# EAGLE board KVR LABS - AEV ENCODER 1.01-STM32 (EAGLE 9.6.1)
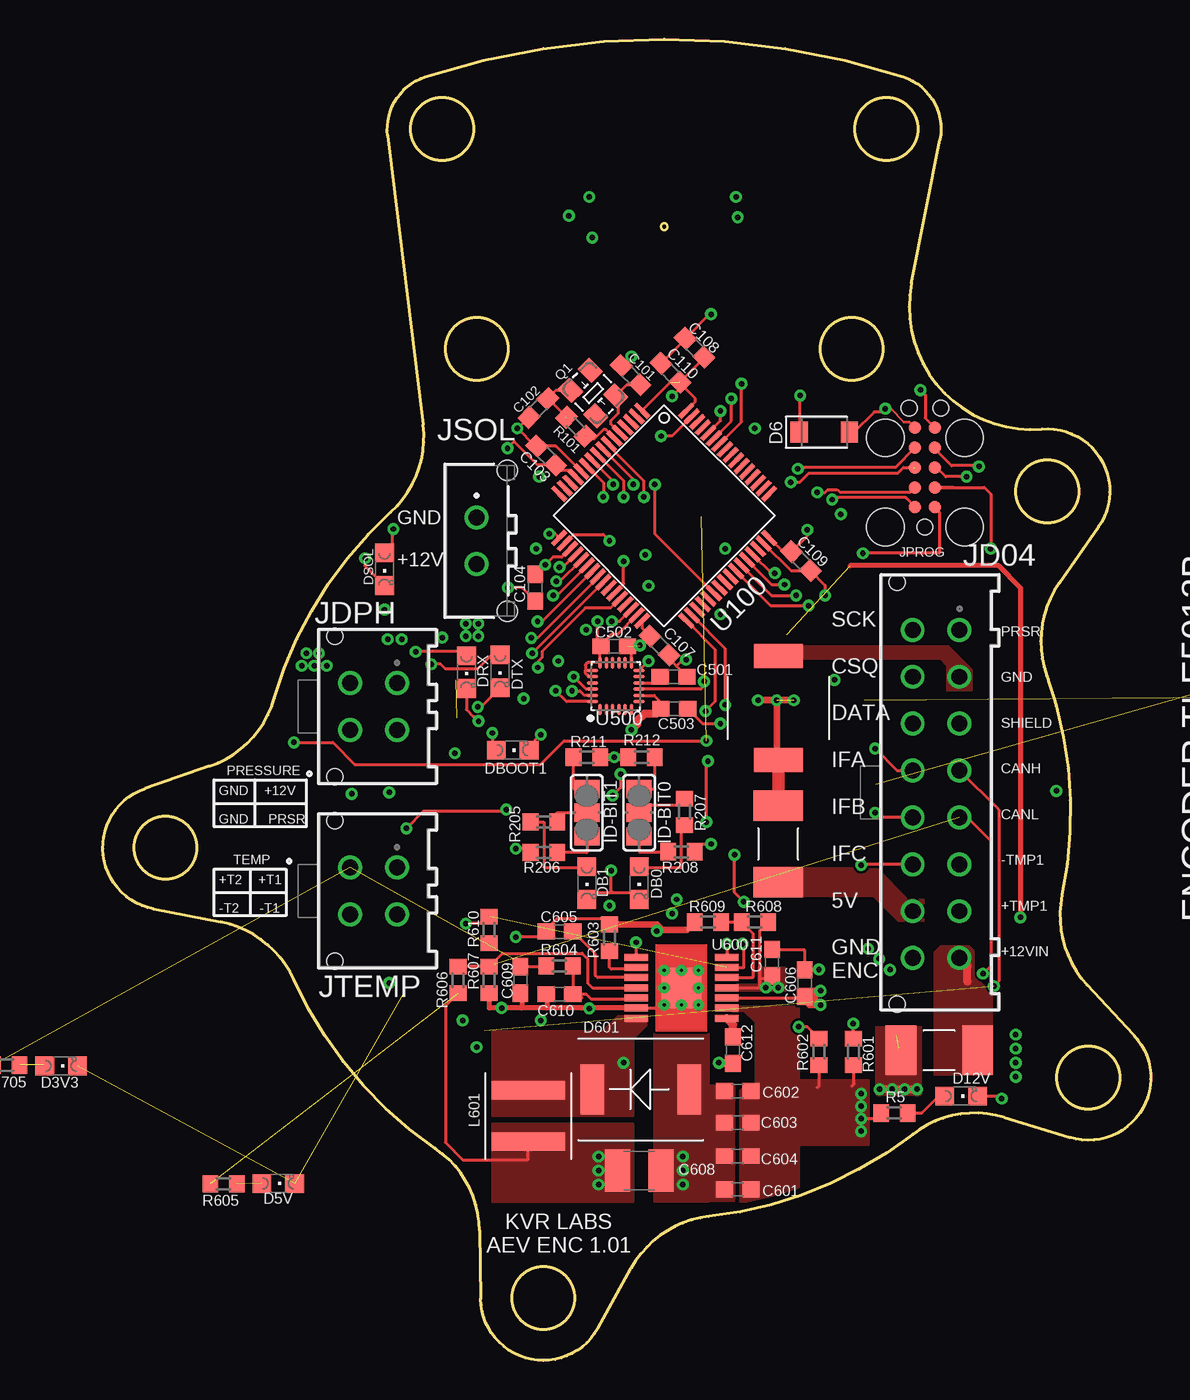
[diagram p9: board, top side]
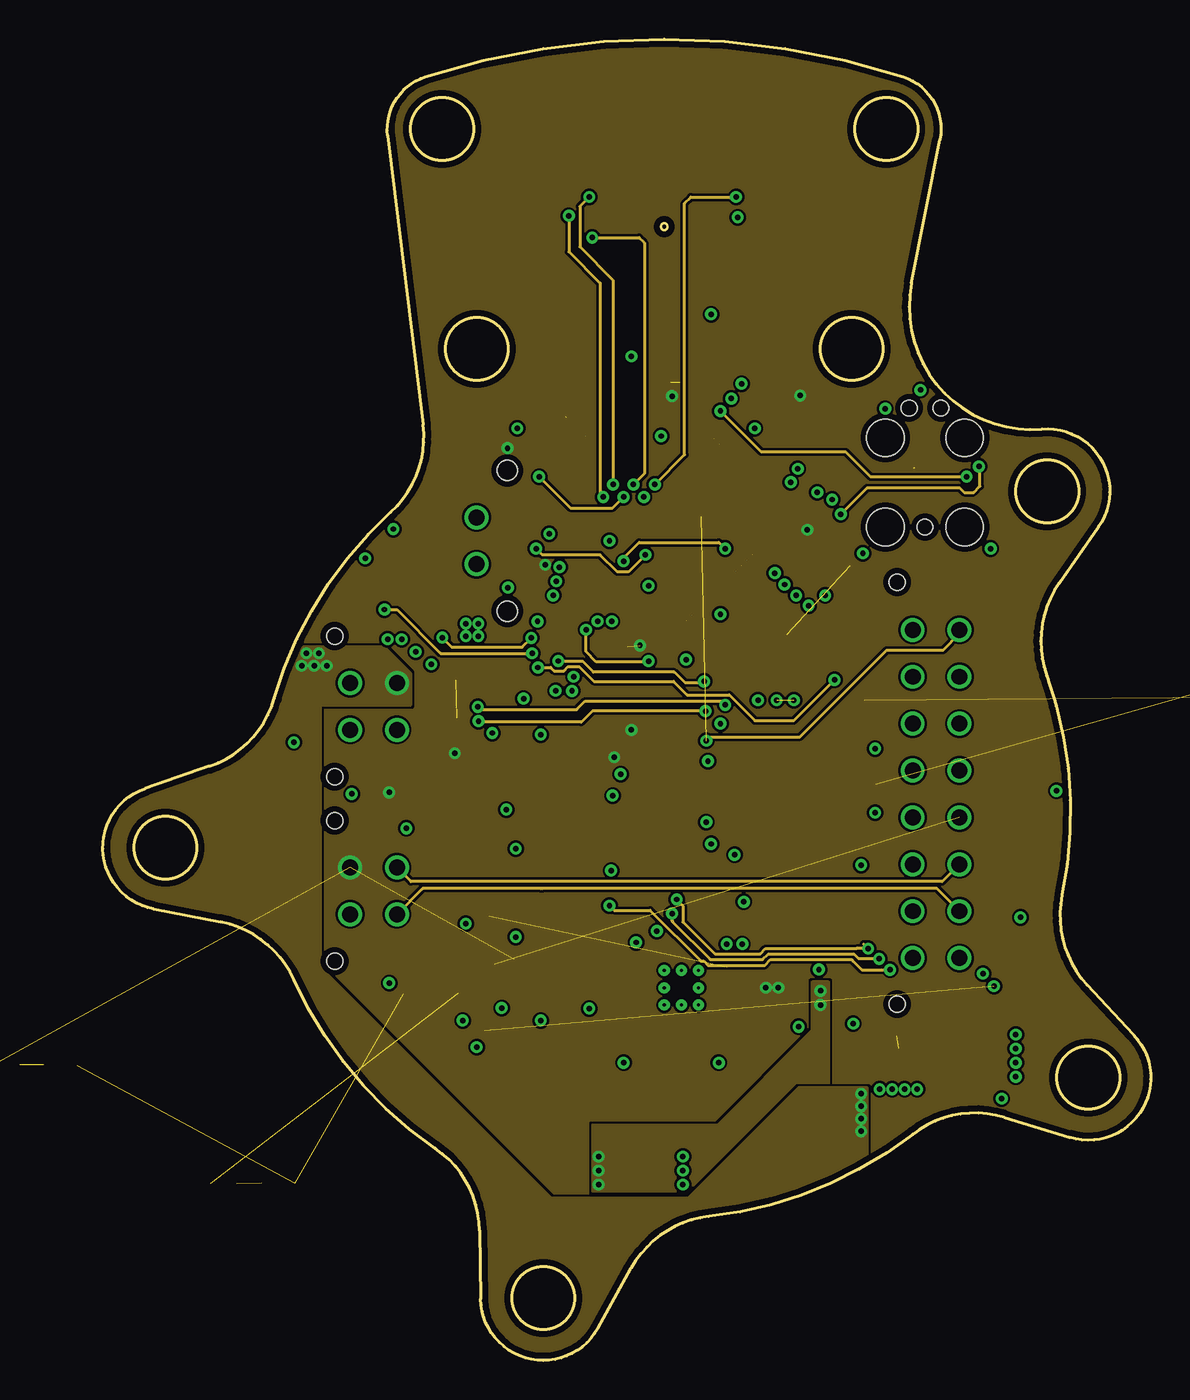
[diagram p10: board, inner layer Route2]
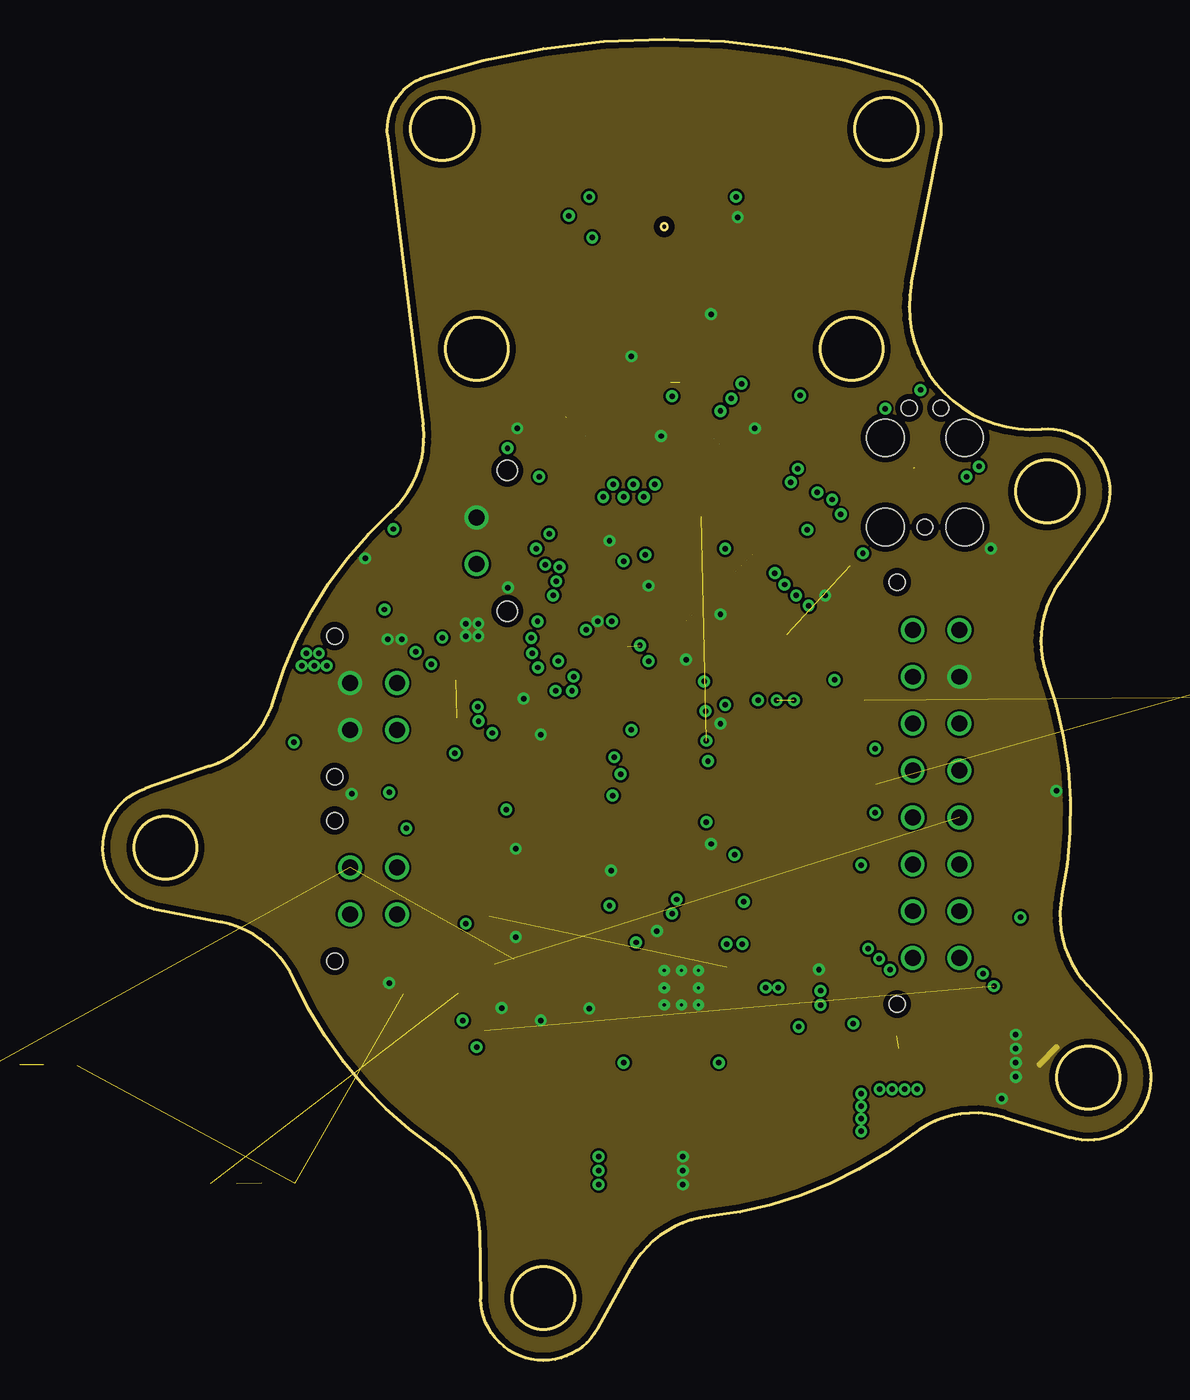
[diagram p11: board, inner layer Route15]
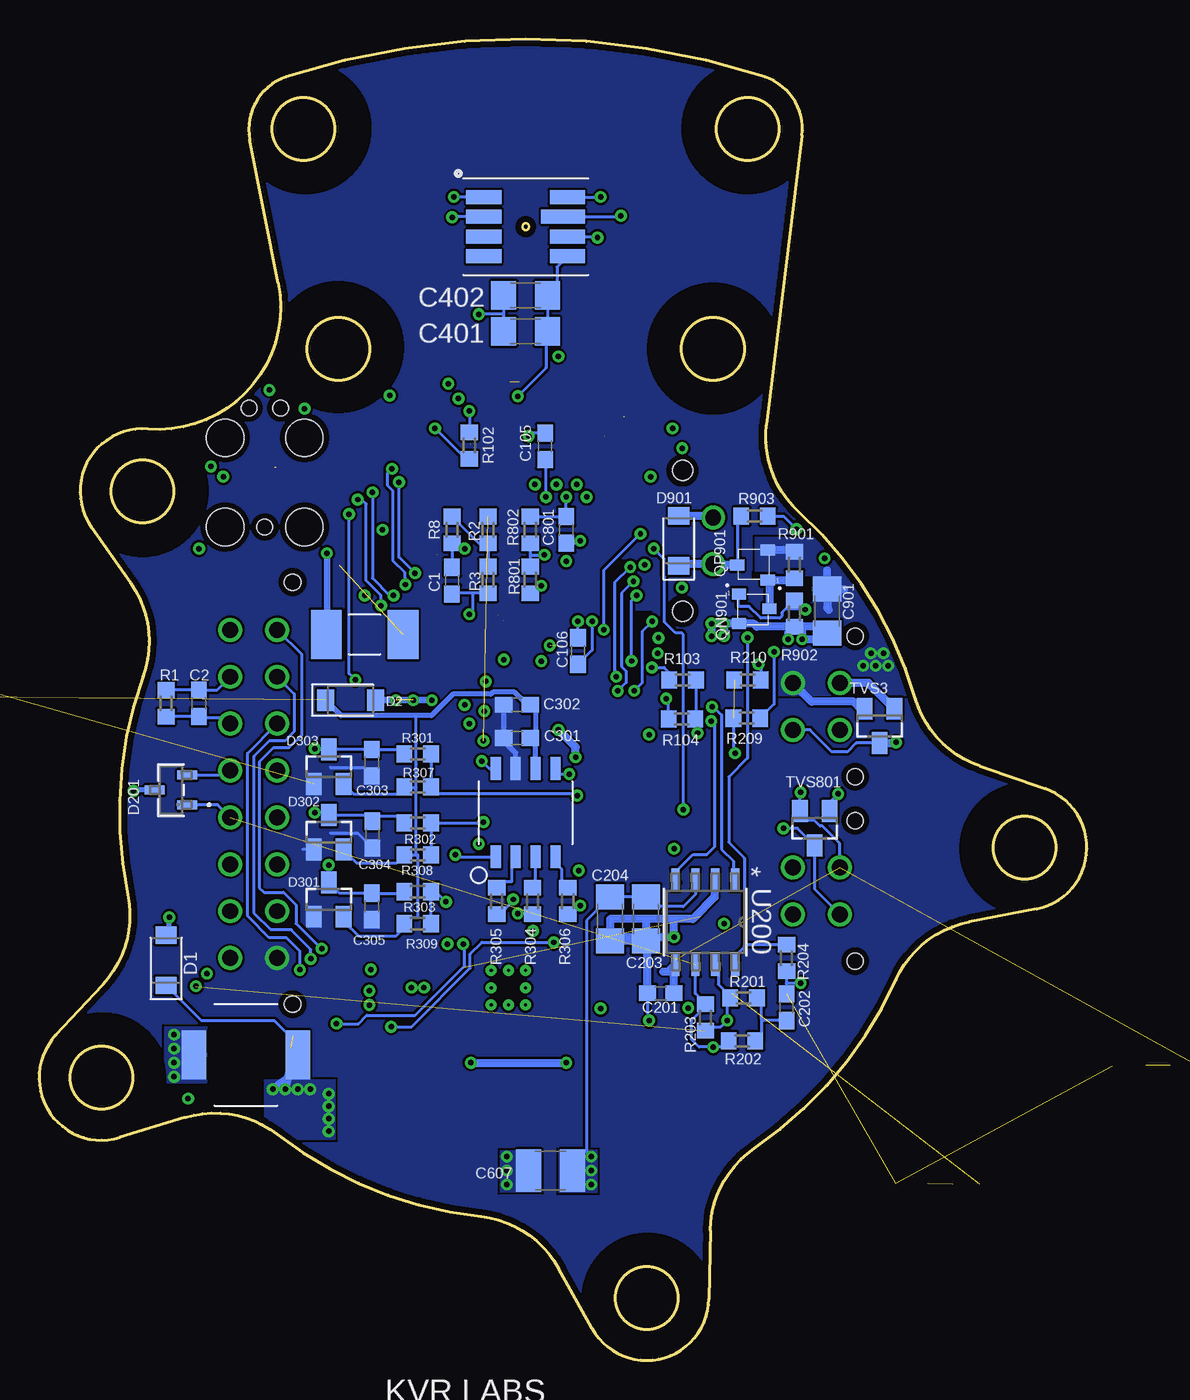
[diagram p12: board, bottom side, seen from below]

Size 67.06 x 84.55 mm. Coordinates in mm from the lower left corner, seen from the top.
Outline: 18.23,78.37 arc-79 20.62,82.13 arc-36 51.22,82.13 arc-83 53.57,78.11 51.75,68.94 arc106 60.1,59.6 arc-130 63.71,53.32 61.2,49.73 arc55 60.4,43.81 arc-31 61.38,29.78 arc55 62.99,24.03 65.98,20.82 arc-150 61.89,14.27 57.69,15.55 arc55 51.82,14.48 arc-31 38.78,9.21 arc55 33.81,5.9 31.68,2.06 arc-150 24.18,3.93 24.1,8.32 arc55 21.27,13.57 arc-31 12.23,24.35 arc55 7.54,28.05 3.24,28.89 arc-150 2.7,36.6 6.84,38.03 arc55 10.97,42.35 arc-31 18.42,54.28 arc55 20.5,59.88 18.23,78.37
Outline: circle at 28.18,4 radius 2
Outline: circle at 4,32.82 radius 2
Outline: circle at 23.93,64.72 radius 2
Outline: circle at 21.71,78.8 radius 2
Outline: circle at 50.14,78.8 radius 2
Outline: circle at 60.43,55.62 radius 2
Outline: circle at 63.06,18.09 radius 2
Outline: circle at 35.92,72.55 radius 0.2
Outline: circle at 47.91,64.72 radius 2
Copper layers (1*2*15*16): Top 0.035mm / dielectric 1.15mm / Route2 0.035mm / dielectric 0.15mm / Route15 0.035mm / dielectric 0.2mm / Bottom 0.035mm
Design rules "default *": minimum track width 0.14mm, minimum drill 0.35mm, track to track 6mil, track to pad 6mil, pad to pad 6mil, via to via 6mil, smd to smd 0mil, copper to edge 15mil, drill to drill 5mil, minimum pad ring 10mil, minimum via ring 8mil, stop-mask expansion 4mil, vias tented up to drill 0mil, thermal gap 0mil
Net classes: 0 default: width 0.203 mm, drill 0.3 mm, clearance 0.152 mm; 1 power: width 0.175 mm, drill 0.3 mm, clearance 0.175 mm
tRestrict: area 0,28.8 to 8,36.8; area 24.2,-0.1 to 32.2,7.9; area 59,14 to 67,22; area 56.6,51.7 to 64.6,59.7; area 17.6,74.8 to 25.6,82.8; area 46,74.8 to 54,82.8; area 43.9,60.7 to 51.9,68.7; area 19.9,60.6 to 27.9,68.6; area 40.9,17.8 to 41.4,18.4; area 39.8,19.7 to 40.8,20
bRestrict: area 19.5,45.2 to 19.9,46.3; area 17.6,49.7 to 18.7,50.1; area 17.5,47.3 to 17.9,48.4; area 17.6,48.5 to 18,49.6; area 20.2,50 to 21.3,50.4; area 27.9,47.4 to 29,47.8; area 29.2,50.7 to 30.3,51.1; area -0.1,28.7 to 7.9,36.7; area 24.1,-0.1 to 32.1,7.9; area 59,14 to 67,22; area 56.4,51.6 to 64.4,59.6; area 46,74.8 to 54,82.8; area 17.7,74.8 to 25.7,82.8; area 19.9,60.7 to 27.9,68.7; area 43.9,60.8 to 51.9,68.8

## Footprints (pad centres in the part's own frame; a part is rotated, then mirrored left to right if it is on the bottom)
C0603 = smd 1.1 x 1: 1 -0.85,0; 2 0.85,0
C1206 = smd 1.6 x 1.8: 1 -1.4,0; 2 1.4,0
C1210 = smd 1.6 x 2.7: 1 -1.4,0; 2 1.4,0
SODFL3718X115 = smd 1.115 x 1.361: 1 -1.6,0; 2 1.6,0
CHIPLED_0805 = smd 1.2 x 1.2: A 0,-1.05; C 0,1.05
SOT-23_3L_ONS = smd 0.568 x 1.259: 1 -0.953,-1.041; 2 0.953,-1.041; 3 0,1.041
SOT23 = smd 1 x 1.4: 1 -0.95,-1.1; 2 0.95,-1.1; 3 0,1.1
DO-214AB = smd 1.52 x 3.2: ANODE 3.105,0; CATHODE -3.105,0
2410(6125METRIC) = smd 1.96 x 3.15: P1 -2.455,0; P2 2.455,0
SJ_2 = smd 1.168 x 1.6: 1 -1.524,0; 2 0,0; 3 1.524,0
66201621122 = drill 1.02: 1 10.4,-1.5; 2 7.4,-1.5; 3 4.4,-1.5; 4 1.4,-1.5; 5 -1.6,-1.5; 6 -4.6,-1.5; 7 -7.6,-1.5; 8 -10.6,-1.5; 9 10.4,1.5; 10 7.4,1.5; 11 4.4,1.5; 12 1.4,1.5; 13 -1.6,1.5; 14 -4.6,1.5; 15 -7.6,1.5; 16 -10.6,1.5 | hole 1.02: -13.55,2.49; 13.45,2.49
66200421122 = drill 1.02: 1 1.5,-1.5; 2 -1.5,-1.5; 3 1.5,1.5; 4 -1.5,1.5 | hole 1.02: -4.5,2.49; 4.5,2.49
TC2050-IDC = smd 0.787 x 0.787: 1 -2.54,-0.635; 2 -2.54,0.635; 3 -1.27,-0.635; 4 -1.27,0.635; 5 0,-0.635; 6 0,0.635; 7 1.27,-0.635; 8 1.27,0.635; 9 2.54,-0.635; 10 2.54,0.635 | hole 0.991: -3.81,0; 3.81,1.016; 3.81,-1.016 | hole 2.375: -3.81,2.54; -3.81,-2.54; 1.905,2.54; 1.905,-2.54
66200211122 = drill 1.02: 1 1.5,0; 2 -1.5,0 | hole 1.27: 4.5,-1.96; -4.5,-1.96
XAL5030 = smd 1.18 x 4.7: P1 -1.655,0; P2 1.655,0
CRY3225-4 = smd 1.3 x 1.1: 1 -1.15,-0.9; 2 -1.15,0.9; 3 1.15,0.9; 4 1.15,-0.9
SOT323-3_NFET = smd 0.9 x 0.7: D 1.059,0; G -0.889,0.95; S -0.889,-0.95
R0603 = smd 1 x 1.1: 1 -0.85,0; 2 0.85,0
SMC = smd 1.54 x 3.14: P$1 -3.325,0; P$2 3.325,0
LQFP64_STMLIB = smd 0.3 x 1.2: 1 -3.75,-5.75; 2 -3.25,-5.75; 3 -2.75,-5.75; 4 -2.25,-5.75; 5 -1.75,-5.75; 6 -1.25,-5.75; 7 -0.75,-5.75; 8 -0.25,-5.75; 9 0.25,-5.75; 10 0.75,-5.75; 11 1.25,-5.75; 12 1.75,-5.75; 13 2.25,-5.75; 14 2.75,-5.75; 15 3.25,-5.75; 16 3.75,-5.75; 33 3.75,5.75; 34 3.25,5.75; 35 2.75,5.75; 36 2.25,5.75; 37 1.75,5.75; 38 1.25,5.75; 39 0.75,5.75; 40 0.25,5.75; 41 -0.25,5.75; 42 -0.75,5.75; 43 -1.25,5.75; 44 -1.75,5.75; 45 -2.25,5.75; 46 -2.75,5.75; 47 -3.25,5.75; 48 -3.75,5.75 | smd 1.2 x 0.3: 17 5.75,-3.75; 18 5.75,-3.25; 19 5.75,-2.75; 20 5.75,-2.25; 21 5.75,-1.75; 22 5.75,-1.25; 23 5.75,-0.75; 24 5.75,-0.25; 25 5.75,0.25; 26 5.75,0.75; 27 5.75,1.25; 28 5.75,1.75; 29 5.75,2.25; 30 5.75,2.75; 31 5.75,3.25; 32 5.75,3.75; 49 -5.75,3.75; 50 -5.75,3.25; 51 -5.75,2.75; 52 -5.75,2.25; 53 -5.75,1.75; 54 -5.75,1.25; 55 -5.75,0.75; 56 -5.75,0.25; 57 -5.75,-0.25; 58 -5.75,-0.75; 59 -5.75,-1.25; 60 -5.75,-1.75; 61 -5.75,-2.25; 62 -5.75,-2.75; 63 -5.75,-3.25; 64 -5.75,-3.75
SO-8_S_LIT = smd 1.455 x 0.533: 1 -2.721,1.905; 2 -2.721,0.635; 3 -2.721,-0.635; 4 -2.721,-1.905; 5 2.721,-1.905; 6 2.721,-0.635; 7 2.721,0.635; 8 2.721,1.905
PG-DSO-8 = smd 0.65 x 1.45: P1 -1.905,-2.825; P2 -0.635,-2.825; P3 0.635,-2.825; P4 1.905,-2.825; P5 1.905,2.825; P6 0.635,2.825; P7 -0.635,2.825; P8 -1.905,2.825
MS5541C = smd 2.25 x 0.9: P1 -2.675,1.9; P2 -2.675,0.65; P3 -2.675,-0.65; P4 -2.675,-1.9; P5 2.675,-1.9; P6 2.675,-0.65; P8 2.675,1.9 | smd 2.8 x 0.9: P7 2.4,0.65
ICM-20648 = smd 0.738 x 0.22: 1 -1.496,1; 2 -1.496,0.6; 3 -1.496,0.2; 4 -1.496,-0.2; 5 -1.496,-0.6; 6 -1.496,-1; 13 1.496,-1; 14 1.496,-0.6; 15 1.496,-0.2; 16 1.496,0.2; 17 1.496,0.6; 18 1.496,1 | smd 0.22 x 0.738: 7 -1,-1.496; 8 -0.6,-1.496; 9 -0.2,-1.496; 10 0.2,-1.496; 11 0.6,-1.496; 12 1,-1.496; 19 1,1.496; 20 0.6,1.496; 21 0.2,1.496; 22 -0.2,1.496; 23 -0.6,1.496; 24 -1,1.496
14-HTSSOP = smd 1.5 x 0.45: P1 -2.9,1.95; P2 -2.9,1.3; P3 -2.9,0.65; P4 -2.9,0; P5 -2.9,-0.65; P6 -2.9,-1.3; P7 -2.9,-1.95; P8 2.9,-1.95; P9 2.9,-1.3; P10 2.9,-0.65; P11 2.9,0; P12 2.9,0.65; P13 2.9,1.3; P14 2.9,1.95 | smd 2.56 x 2.56: P15 0,0 | drill 0.2 pad 0.35: P16 0,-1.1; P17 0,1.1; P18 -1.1,-1.1; P19 1.1,-1.1; P20 1.1,0; P21 1.1,1.1; P22 -1.1,1.1; P23 -1.1,0

## Placement (x,y rotation side)
C1  .1nF  [C0603]  40.64,49.9 270 bottom
C2  .1nF  [C0603]  56.82,42.05 90 bottom
C101  12pF  [C0603]  33.77,63.05 135 top
C102  12pF  [C0603]  27.87,60.95 225 top
C103  100nF  [C0603]  28.37,57.9 135 top
C104  10uF  [C0603]  27.67,49.45 270 top
C105  100nF  [C0603]  34.67,58.5 90 bottom
C106  4.7uF  [C0603]  32.57,45.4 270 bottom
C107  100nF  [C0603]  35.62,45.75 315 top
C108  100nF  [C0603]  37.87,64.8 135 top
C109  100nF  [C0603]  44.67,51.15 315 top
C110  100nF  [C0603]  36.32,63.2 135 top
C201  0.1uF  [C0603]  27.27,23.5 180 bottom
C202  0.1uF  [C0603]  19.22,22.6 90 bottom
C203  22uF  [C1206]  28.22,28.25 270 bottom
C204  22uF  [C1206]  30.52,28.25 270 bottom
C301  1uF  [C0603]  36.47,39.83 180 bottom
C302  100nF  [C0603]  36.47,41.97 180 bottom
C303  DNP  [C0603]  45.77,38.25 270 bottom
C304  DNP  [C0603]  45.72,33.65 270 bottom
C305  DNP  [C0603]  45.77,29.05 270 bottom
C401  22uF  [C1206]  35.92,65.85 180 bottom
C402  22uF  [C1206]  35.92,68.15 180 bottom
C501  0.1uF  [C0603]  36.52,43.75 0 top
C502  0.1uF  [C0603]  32.72,45.7 180 top
C503  0.1uF  [C0603]  36.57,41.7 0 top
C601  22uF  [C0603]  40.62,10.95 180 top
C602  22uF  [C0603]  40.62,17.25 180 top
C603  22uF  [C0603]  40.62,15.22 180 top
C604  22uF  [C0603]  40.62,13.08 180 top
C605  3.3nF  [C0603]  29.22,27.45 180 top
C606  4.7uF  [C0603]  44.92,24.15 90 top
C607  47uF  [C1210]  34.32,12.15 180 bottom
C608  47uF  [C1210]  34.32,12.15 0 top
C609  4.7nF  [C0603]  26.72,24.35 270 top
C610  12pF  [C0603]  29.22,23.45 180 top
C611  10uF  [C0603]  42.82,25.45 90 top
C612  0.1uF  [C0603]  40.32,19.85 90 top
C801  100nF  [C0603]  33.32,53.15 270 bottom
C901  22uF  [C1206]  16.62,47.95 270 bottom
D1  MBR0520LT1G  [SODFL3718X115]  58.92,25.6 90 bottom
D2  MBR0520LT1G  [SODFL3718X115]  47.12,42.25 0 bottom
D3V3  [CHIPLED_0805]  -2.68,18.85 270 top
D5V  [CHIPLED_0805]  11.22,11.32 270 top
D5V_ENC  [CHIPLED_0805]  80.39,46.75 180 top  (outside the outline)
D6  MBR0520LT1G  [SODFL3718X115]  46.17,59.4 0 top
D12V  [CHIPLED_0805]  54.92,16.92 270 top
D201  μCLAMP2492SQ  [SOT-23_3L_ONS]  58.62,36.5 90 bottom
D301  BAS70-04  [SOT23]  48.52,29.5 0 bottom
D302  BAS70-04  [SOT23]  48.52,33.8 0 bottom
D303  BAS70-04  [SOT23]  48.52,38 0 bottom
D601  SL44  [DO-214AB]  34.42,17.35 0 top
D901  MBR0520LT1G  [SODFL3718X115]  26.12,52.45 90 bottom
DB0  [CHIPLED_0805]  34.32,30.55 180 top
DB1  [CHIPLED_0805]  30.97,30.55 180 top
DBOOT1  [CHIPLED_0805]  26.22,39.05 270 top
DRX  [CHIPLED_0805]  23.27,44.05 180 top
DSOL  [CHIPLED_0805]  18.02,50.63 180 top
DTX  [CHIPLED_0805]  25.42,44.1 180 top
F1  0679L3000  [2410(6125METRIC)]  53.52,19.85 0 top
F2  0679L0250  [2410(6125METRIC)]  43.22,33.05 90 top
F3  0679L0250  [2410(6125METRIC)]  46.22,46.45 0 bottom
ID-BIT0  [SJ_2]  34.32,35.05 270 top
ID-BIT1  [SJ_2]  30.97,35.05 270 top
JD04  [66201621122]  53.32,36.35 90 top
JDPH  [66200421122]  17.32,41.85 90 top
JPROG  TC2050-IDC  [TC2050-IDC]  52.61,57.14 90 top
JSOL  [66200211122]  23.92,52.45 90 top
JTEMP  [66200421122]  17.32,30.05 90 top
L601  XAL5030  [XAL5030]  27.22,15.65 270 top
Q1  16MHz  [CRY3225-4]  31.37,61.9 315 top
QN901  FDV305N  [SOT323-3_NFET]  21.37,48.1 0 bottom
QP901  ZXM61P02FTA  [SOT323-3_NFET]  21.32,50.9 180 bottom
R1  1M  [R0603]  58.92,42.05 90 bottom
R2  10k  [R0603]  38.32,53.15 270 bottom
R3  10k  [R0603]  38.32,49.95 270 bottom
R5  10k  [R0603]  50.65,15.83 180 top
R6  10k  [R0603]  80.37,43.37 270 top  (outside the outline)
R8  100  [R0603]  40.62,53.15 270 bottom
R101  220  [R0603]  30.27,59.75 315 top
R102  100k  [R0603]  39.52,58.55 270 bottom
R103  10k  [R0603]  25.87,43.55 0 bottom
R104  100k  [R0603]  25.92,41.05 180 bottom
R201  60  [R0603]  21.97,23.2 180 bottom
R202  60  [R0603]  22.07,20.45 0 bottom
R203  DNP  [R0603]  24.42,21.95 270 bottom
R204  10k  [R0603]  19.22,25.75 90 bottom
R205  10k  [R0603]  28.22,34.45 180 top
R206  1k  [R0603]  28.22,32.5 180 top
R207  10k  [R0603]  37.22,35.1 270 top
R208  1k  [R0603]  37.02,32.55 0 top
R209  1k  [R0603]  21.77,41.1 180 bottom
R210  1k  [R0603]  21.72,43.55 180 bottom
R211  1k  [R0603]  30.97,38.6 180 top
R212  1k  [R0603]  34.47,38.6 0 top
R301  0  [R0603]  42.82,38.8 180 bottom
R302  0  [R0603]  42.82,34.4 180 bottom
R303  0  [R0603]  42.82,30 180 bottom
R304  100  [R0603]  35.47,29.4 270 bottom
R305  100  [R0603]  37.77,29.4 270 bottom
R306  470  [R0603]  33.22,29.4 270 bottom
R307  DNP  [R0603]  42.82,36.7 180 bottom
R308  DNP  [R0603]  42.82,32.35 180 bottom
R309  DNP  [R0603]  42.82,27.95 180 bottom
R601  10k  [R0603]  48.02,19.75 270 top
R602  10k  [R0603]  45.82,19.75 270 top
R603  47k  [R0603]  32.42,27.05 270 top
R604  22k  [R0603]  29.22,25.25 0 top
R605  10k  [R0603]  7.72,11.3 180 top
R606  56.25k  [R0603]  22.72,24.35 270 top
R607  10k  [R0603]  24.72,24.35 90 top
R608  95.3k  [R0603]  41.72,28.05 0 top
R609  18k  [R0603]  38.72,28.05 0 top
R610  DNP  [R0603]  24.72,27.55 90 top
R705  10k  [R0603]  -6.18,18.9 180 top  (outside the outline)
R801  10k  [R0603]  35.62,49.95 270 bottom
R802  100  [R0603]  35.62,53.15 90 bottom
R901  10k  [R0603]  18.72,50.9 90 bottom
R902  10k  [R0603]  18.72,47.8 90 bottom
R903  10k  [R0603]  21.27,54.02 180 bottom
TVS1  SM15T18AY  [SMC]  53.82,19.55 0 bottom
TVS2  SM15T6V8AY  [SMC]  43.22,41.75 270 top
TVS3  BAS70-04  [SOT23]  13.27,40.6 180 bottom
TVS801  BAS70-04  [SOT23]  17.42,34.05 180 bottom
U100  STM32F413RGT6  [LQFP64_STMLIB]  35.92,54.05 225 top
U200  TJA1044GT/3  [SO-8_S_LIT]  24.42,28.05 270 bottom
U300  TLE5012B  [PG-DSO-8]  35.92,35.05 0 bottom
U400  MS5541C  [MS5541C]  35.92,72.55 0 bottom
U500  ICM-20648  [ICM-20648]  32.82,43.15 90 top
U600  TPS65321-Q1  [14-HTSSOP]  37.02,23.85 180 top

## Tracks (layer width: path | path; a pad name or v marks a point on that pad's centre or on a via)
+3V3  (via drill 0.35)  (5 unrouted)
  Top 0.203: U500.13 33.82,45.35 C502.1 34.37,45.7 C107.1 34.51,46.86 U100.32 | U500.8 35.27,42.55 35.8,42.02 C503.1 | 36.92,62.35 C110.1 38.47,64.15 C108.1 | 36.92,62.35 36.92,62.2 v36.42,61.7 | U100.13 30.26,56.54 29.85,56.96 29.32,56.96 C103.1 27.82,57.3 26.32,58.8 v25.9,58.37 | U100.1 36.34,62.6 | U100.64 37.92,61.35 37.92,61.55 37.12,62.35 36.92,62.35 | U100.48 43.52,51.75 C109.1 45.08,52.76 v45.08,53.15 | U100.19 29.38,51.4 28.79,51.4 v28.31,50.92 27.69,50.3 C104.1 | 33.52,38.6 R212.1 | v44.62,61.75 44.57,61.7 D6.1 | C611.1 42.82,24.45 | 42.02,24.45 42.02,23.85 | U600.P4 42.02,23.85 | R608.2 42.02,27.5 42.02,24.45 | 42.02,24.45 42.42,24.45 | 42.42,24.45 42.82,24.45 | v42.42,23.85 42.42,24.45 | 42.02,23.85 v42.42,23.85 | v42.42,23.85 v43.22,23.85 42.82,24.25 42.82,24.45
  Top 0.5: C503.1 35.4,41.38 34.65,41.38 34.19,40.92 34.19,40.72 v33.82,40.35 | R211.1 v32.72,38.6 33.52,38.6
  Bottom 0.203: R209.2 22.62,38.95 v22.52,38.85 | U200.5 26.33,25.65 | JTEMP.3 15.82,33.1 16.92,34.2 17.08,34.2 17.43,34.55 18.02,34.55 18.37,34.9 TVS801.2 18.37,36.3 v18.32,36.35 | U400.P5 33.92,69.97 33.92,68.75 C402.1 C401.1 34.62,65.75 34.62,63.5 v36.42,61.7
  Bottom 0.5: C201.1 26.42,25.23 | 26.42,25.23 U200.5 | 27.12,24.88 26.77,24.88 26.42,25.23 | v32.72,38.6 32.72,39.25 v33.82,40.35
  other vias: 34.37,45.75
  pour Route2 (isolate 0.127, rank 6): -15.68,63.7 -15.68,16.55 15.87,-15 64.27,-15 93.42,14.15 93.42,58.2 65.52,86.1 6.72,86.1
  pour Top: 40.52,23.65 43.72,23.65 43.72,25.15 41.92,25.15 41.92,24.05 40.52,24.05
+5V  (via drill 0.35)  (1 unrouted)
  Top 0.203: R606.2 21.92,22.7 21.92,13.95 23.02,12.85 27.18,12.85 27.22,12.89 L601.P2 | U600.P3 44.82,23.2 C606.1 44.62,23
  Top 0.406: 45.37,23.3 C606.1 45.27,23.65 v45.92,23.65 45.47,23.2 | 45.47,23.2 45.37,23.3 | 45.47,23.2 v45.92,22.75 45.22,22.75 45.22,23.15 45.37,23.3
  Bottom 0.203: U200.3 25.06,29.81 25.82,29.05 27.62,29.05 28.02,29.45 | C203.1 30.12,29.65 30.32,29.45 | C204.1 32.02,28.15 32.02,13.35 v31.72,13.05
  Bottom 0.5: 28.02,29.45 C203.1 28.42,29.45 | C204.1 30.32,29.45 30.81,29.45
  other vias: 31.72,12.15 31.72,11.25
  pour Top: 33.92,10.15 33.92,15.15 24.92,15.15 24.92,10.15
  pour Bottom: 33.82,10.75 31.32,10.75 31.32,13.45 33.82,13.45
  pour Route2 (rank 2): 31.32,14.35 32.02,15.05 39.32,15.05 45.42,21.15 45.42,24.25 46.42,24.25 46.42,17.35 43.42,14.35
  pour Route2 (rank 3): 42.22,15.05 31.32,15.05 31.32,10.85 42.22,10.85
+5V/1  (1 unrouted)
  Bottom 0.203: D303.2 46.92,36.25 44.02,36.25 43.67,36.6 R307.2 43.62,36.65 42.92,36.65 | D301.2 47.57,28.1 46.62,27.15 44.22,27.15 43.67,27.7 R309.2 43.27,28.35 42.82,28.35 42.82,32.35 42.92,32.35 | 42.92,32.35 42.92,36.65 | 42.92,36.65 42.92,38.14 42.92,39.45 42.92,39.46 42.92,41.26 | 42.92,32.35 R308.2 44.17,31.85 46.72,31.85 D302.2 47.52,32.65 | C302.1 35.91,41.97 36.67,42.72 39.72,42.72
  Bottom 0.305: U300.P6 35.29,39.75 | 35.29,39.75 35.29,41.63 C302.1 35.84,41.97 36.65,42.77 38,42.77 38.14,42.63 40.57,42.63 41.94,41.26 42.92,41.26 47.74,41.26 D2.1 | C301.1 35.54,39.75 35.29,39.75
+12V  (via drill 0.35)  (1 unrouted)
  Top 0.203: R5.2 49.43,15.47 v48.52,15.47 | R602.2 45.82,17.55 45.72,17.45 | R601.2 48.02,17.65 47.92,17.55
  Top 0.5: v52.11,17.35 v51.31,17.35 v50.51,17.35 v49.71,17.35
  Bottom 0.203: D1.1 56.67,21.75 52.01,21.75 50.28,20.02
  Bottom 0.5: TVS1.P$2 50.49,19.51 50.75,19.25 | 50.75,18.35 50.73,18.37 v52.11,17.35 | 50.28,20.02 50.63,19.66 | TVS1.P$2 50.51,19.54 50.63,19.66 | 50.64,20.77 50.72,20.85 50.81,20.77 | v51.31,17.35 50.83,19.17 50.75,19.25 | 50.94,19.97 50.63,19.66 | 50.75,19.25 50.55,19.05 50.12,19.05 50.5,19.42 TVS1.P$2 | R901.2 18.82,51.85 QP901.S | 14.27,41.75 TVS3.2 14.47,41.7 14.92,42.15 17.62,42.15 JDPH.1 | C901.1 16.62,50.55 | C901.1 15.52,49.35 | C901.1 16.62,48.15 16.52,48.05
  other vias: 48.52,14.67 48.52,16.27 48.52,17.07 13.02,45.25 12.72,44.45 13.52,44.45 13.82,45.25 14.32,44.45
  pour Bottom: 52.62,17.95 48.12,17.95 48.12,14.15 52.62,14.15
  pour Bottom: 49.02,17.75 49.02,14.15 48.12,14.15 48.12,17.75
  pour Top: 49.02,13.75 44.32,13.75 44.32,17.95 49.02,17.95
  pour Bottom: 21.22,42.55 21.22,52.65 15.32,52.65 11.02,48.35 11.02,42.55
  pour Top: 40.22,22.35 41.02,22.35 41.72,21.65 41.72,17.65 41.12,17.65 40.72,17.25 40.72,10.15 44.62,10.15 44.62,22.65 40.22,22.65
  pour Top: 49.42,21.35 49.42,17.05 49.52,16.95 52.32,16.95 52.42,17.05 52.42,21.35
  pour Route2: 19.72,43.95 18.02,45.65 12.82,45.65 12.32,45.15 12.32,41.95 19.72,41.95
  pour Route2: -0.98,35.05 -0.98,17.75 18.12,-1.35 48.92,-1.35 48.92,17.45 44.52,17.45 37.44,10.37 28.7,10.37 13.92,25.15 13.92,44.45 13.52,44.85 8.82,44.85
+12VCC
  Bottom 0.203: R903.2 22.38,53.77 QP901.D
  Bottom 0.5: D901.1 26.02,50.95 JSOL.2 23.87,50.9 QP901.D
+M1TEMP
  Route2 0.203: JD04.6 53.72,30.65 19.72,30.65 JTEMP.1
-M1TEMP
  Route2 0.203: JD04.7 53.37,30.2 28.12,30.2 28.02,30.2 20.47,30.2 JTEMP.2
-M2TEMP  (via drill 0.35)
  Top 0.203: v19.42,34.05 20.52,35.15 25.72,35.15 v25.82,35.25
  Route2 0.203: v34.72,51.55 33.62,50.45 32.92,50.45 31.82,51.55 28.12,51.55 v27.72,51.95
  Bottom 0.203: JTEMP.4 17.42,30.15 TVS801.3 18.52,34.05 v19.42,34.05 | R801.1 35.62,51.55 | 35.62,51.55 R802.1 | 35.62,51.55 v34.72,51.55 | v25.82,35.25 25.82,40.39 25.83,40.39 25.83,46.45 25.93,46.55 26.32,46.55 27.02,47.25 27.02,50.15 27.06,50.19 27.06,51.28 v27.72,51.95
BOOT
  Top 0.508: C612.2 40.32,21.5 U600.P1
BOOT0  (via drill 0.35)
  Top 0.203: JPROG.5 53.35,57.14 53.94,56.55 v55.27,56.55 | U100.60 39.52,60.12 v39.52,60.75
  Route2 0.203: v39.52,60.75 42.12,58.15 47.52,58.15 49.12,56.55 v55.27,56.55
  Bottom 0.203: v39.52,60.75 R102.1
CANH  (via drill 0.35)  (1 unrouted)
  Top 0.203: v57.02,23.95 57.32,24.25 57.32,35.25 JD04.4
  Bottom 0.203: D201.2 55.12,37.45 JD04.4 | U200.7 23.59,25.13 23.59,24.06 22.82,23.3 R201.2 23.02,23 v23.02,21.75 23.42,21.35 24.07,21.35 24.32,21.1 R203.2
CANL  (via drill 0.35)  (1 unrouted)
  Top 0.203: v56.32,24.75 56.82,25.25 56.82,33.25 55.32,34.75 JD04.5
  Bottom 0.203: JD04.5 55.62,35.55 D201.1 | U200.6 25.06,23.48 24.42,22.85 R203.1 24.42,22.65 25.32,21.75 25.32,20.55 24.82,20.05 v23.92,20.05 23.32,20.05 R202.1
COMP
  Top 0.203: U600.P12 34.07,23.15 31.22,23.15 30.92,23.45 C610.1 R604.2
  Top 0.305: C610.1 30.32,23.45 30.57,23.2 | R604.2 30.12,25.2
CSQ  (via drill 0.35)
  Route2 0.203: v36.42,28.6 36.42,28.15 36.45,28.07 38.87,25.65 42.22,25.65 42.58,26.01 48.07,26.01 48.37,25.7 v49.67,25.7
  Bottom 0.203: v36.42,28.6 35.92,28.6 35.87,28.55 R304.2 | JD04.10 50.72,42.65 50.72,40.25 51.32,39.65 52.32,39.65 53.32,38.65 53.32,28.65 52.22,27.55 50.92,27.55 49.67,26.3 v49.67,25.7
DATA  (via drill 0.35)
  Route2 0.203: v50.37,25 48.57,25 48.02,25.55 47.92,25.65 | v32.42,29.1 32.72,28.8 35.02,28.8 38.26,25.56 38.46,25.56 38.72,25.29 42.37,25.29 42.72,25.65 47.92,25.65 | 47.92,25.65
  Bottom 0.203: R306.2 32.97,28.55 v32.42,29.1 | JD04.11 53.72,38.85 53.72,28.45 52.32,27.05 51.22,27.05 50.37,26.2 v50.37,25
EN1  (via drill 0.35)
  Top 0.203: R602.1 45.07,21.35 v44.52,21.35 | v34.12,26.75 U600.P8
  Bottom 0.203: v44.52,21.35 43.22,21.35 39.47,25.1 39.47,26.01 38.72,26.75 v34.12,26.75
EN2  (via drill 0.35)
  Top 0.203: R601.1 v48.02,21.55 | v39.92,26.65 U600.P7
  Bottom 0.203: v48.02,21.55 46.62,21.55 46.08,22.08 42.99,22.08 39.82,25.25 39.82,26.55 v39.92,26.65
FB1
  Top 0.203: R606.1 R607.2 25.58,26.05 30.68,26.05 31.02,25.71 31.02,24.15 31.32,23.85 U600.P11
FB2
  Top 0.203: R609.2 R608.1 41.62,27.3 41.62,24.55 41.57,24.5 U600.P5
GND  (via drill 0.35)  (2 unrouted)
  Top 0.203: 54.47,55.85 53.32,55.85 53.27,55.89 JPROG.3 56.4,55.87 56.82,55.45 v56.82,51.95 | U500.19 30.87,44.15 | U500.20 31.13,43.75 30.87,44 30.87,44.15 | 30.87,44.15 30.87,44.5 31.02,44.65 31.03,44.65 U500.18 31.82,45.55 C502.2 | U100.12 29,58.5 C103.2 27.67,58.5 v26.52,59.65 26.57,59.65 C102.2 | U600.P13 35.72,22.55 U600.P21 | R603.1 32.27,27.9 31.92,28.25 29.02,28.25 28.37,27.6 C605.2 28.02,27.1 v26.42,27.1 | 25.62,22.55 v25.52,22.55 | 30.62,22.55 30.65,22.52 v31.12,22.52 | 42.92,26.3 C611.2 44.87,26.3 44.92,26.25 C606.2 45.81,25 v45.82,25.02 | D12V.C 57.35,16.92 v57.52,16.75 | v46.22,48.95 46.22,49.6 C109.2 44.02,50.55 U100.47 | C110.2 37.27,65.35 C108.2 38.82,66.95 v38.92,66.95 | U100.63 36.43,59.15 v35.72,59.15 | C101.2 33.77,64.25 v33.82,64.25 | R206.2 27.12,32.75 v26.42,32.75 | DB1.C 31.42,29.95 32.62,29.95 | DB0.C 33.87,29.95 32.62,29.95 | 32.62,29.95 32.52,30.05 v32.52,31.35 | R208.2 38.37,33.05 v38.92,33.05 | 36.7,44.42 C501.2 | 36.7,44.42 36.22,44.9 C107.2 | 36.7,44.42 37.12,44.85 v37.32,44.85 | U100.31 32.92,46.45 32.91,46.45 32.52,46.45 31.87,45.8 C502.2 | C502.2 31.66,45.91 v31.66,47.29 | C104.2 26.82,49.45 v25.92,49.45 | U100.18 30.13,52.85 32.02,52.85 v32.42,52.45 | DSOL.C 16.78,50.82 v16.78,51.33 | DBOOT1.C 27.27,39.3 v28.02,40.05 | C503.2 38.37,40.75 v39.52,40.75
  Top 0.305: U600.P13 30.62,22.55 28.42,22.55 | C610.2 28.42,23.4 28.42,22.55 | 28.42,22.55 26.82,22.55 | 26.82,22.55 25.62,22.55 | v25.52,22.55 24.72,22.55 R607.1 | C609.2 26.82,23.4 26.82,22.55
  Top 0.406: R603.1 35.47,27.9 | 35.47,27.9 35.82,27.55 37.37,27.55 R609.1 | 35.47,27.9 35.47,27.5 v35.45,27.48
  Route15 0.406: 61.02,20.02 59.95,18.95
  Bottom 0.203: 23.72,30.84 U200.2 | R104.2 26.77,42.2 v26.92,42.35 | 34.72,59.4 C105.2 35.52,59.35 v35.72,59.15 | TVS801.1 16.47,35.7 v15.92,36.25 | R1.2 C2.2 55.67,42.9 JD04.2 | C402.2 37.32,66.95 | 37.32,66.95 C401.2 | U400.P2 40.57,73.2 v40.62,73.15 | 37.32,66.95 v38.92,66.95 | R204.1 19.27,24.85 19.25,24.15 | 19.25,24.15 C202.2 | 19.25,24.15 19.24,24.15 v18.32,24.15 | R102.2 39.77,57.7 v41.72,59.65 | R3.2 39.32,49.1 | 39.32,49.1 40.59,49.1 C1.2 | 39.32,49.1 39.32,47.95 v39.52,47.75 | R801.2 35.15,49.57 v34.92,49.57 | C801.2 32.57,52.3 v32.42,52.45 | C201.2 28.12,21.85 v28.02,21.75 | v31.66,47.29 31.66,45.46 C106.2
  Bottom 0.305: D201.3 60.97,36.5 v61.02,36.45
  Bottom 0.5: JSOL.1 24.02,54.05 D901.2 | TVS3.1 13.97,43.35 JDPH.3 | 18.32,46.95 17.02,46.95 C901.2 17.02,46.15 v18.22,46.15 18.22,46.85 18.32,46.95 | 18.32,46.95 R902.1 | R902.1 18.92,47.15 | v23.22,47.15 QN901.S 21.32,47.15 21.12,46.95 R902.1 | v23.22,47.15 v24.02,47.15 v24.02,46.35 | v23.22,47.15 v23.22,46.35 | R902.1 19.12,46.55 v19.12,46.15 | U200.2 23.79,30.37 23.82,30.34 23.82,29.65 25.22,28.25 26.42,28.25 | 26.42,28.25 28.22,28.25 | 28.22,28.25 C203.2 | C203.2 C204.2 | 28.22,28.25 30.52,28.25 C204.2 | C204.2 30.27,27.1 v26.42,27.1 26.42,28.25 | C201.2 28.12,26.75 C203.2
  other vias: 58.42,20.85 58.42,19.95 58.42,19.05 58.42,18.15 37.12,11.25 37.12,12.15 37.12,13.05
  pour Bottom: 56.32,17.75 59.02,17.75 59.02,21.35 56.32,21.35
  pour Route15 (rank 6): -6.03,87.7 -6.03,16.25 17.62,-7.4 54.22,-7.4 80.32,18.7 80.32,66.65 59.27,87.7
  pour Top (rank 3): 35.22,26.75 35.22,10.15 38.82,10.15 38.82,26.75
  pour Top: 40.42,17.65 40.42,10.15 37.92,10.15 37.92,17.25 38.32,17.65
  pour Bottom: 34.92,13.45 34.92,10.75 37.52,10.75 37.52,13.45
  pour Top: 41.72,45.45 43.82,45.45 44.12,45.75 54.12,45.75 55.62,44.25 55.62,42.85 54.02,42.85 54.02,44.45 53.62,44.85 41.72,44.85
GND1  (1 unrouted)
  Bottom 0.203: D302.1 50.17,32.7 | C303.2 46.32,37.95 48.42,37.95 | C304.2 46.67,33.75 48.42,33.75
  Bottom 0.305: C302.2 C301.2 37.32,39.65 36.56,38.88 U300.P7
  pour Bottom (isolate 0.127, rank 6): -11.98,56.8 -11.98,13.35 9.82,-8.45 54.17,-8.45 79.82,17.2 79.82,55.55 49.37,86 17.22,86
ID-BIT0
  Top 0.203: 34.32,35.12 ID-BIT0.2 34.82,35.55 36.82,35.55 R207.1
ID-BIT1
  Top 0.203: R205.1 29.07,35.05 ID-BIT1.2
IFA  (via drill 0.35)
  Top 0.203: v49.42,39.15 50.82,37.75 JD04.12
  Bottom 0.203: 48.42,39.2 D303.3 | D303.3 C303.1 43.97,39.1 R301.2 | D303.3 49.37,39.1 v49.42,39.15
IFB  (via drill 0.35)
  Top 0.203: JD04.13 49.72,34.75 v49.42,35.05
  Bottom 0.203: 48.22,34.6 D302.3 | D302.3 45.69,34.9 45.61,34.83 C304.1 45.37,34.85 44.12,34.85 R302.2 | D302.3 48.67,35.05 v49.42,35.05
IFC  (via drill 0.35)
  Top 0.203: JD04.14 48.57,31.75 v48.52,31.7
  Bottom 0.203: R303.2 43.77,29.9 C305.1 47.82,29.9 D301.3 v48.52,31.7
N$1
  Bottom 0.5: R901.1 18.82,49.95 QP901.G 20.31,49.83 QN901.D
N$2  (1 unrouted)
  Top 0.305: -3.78,18.9 D3V3.A
N$3
  Top 0.203: JD04.15 51.42,28.35
  pour Top: 41.92,29.75 49.32,29.75 50.92,28.15 52.52,28.15 52.52,29.45 51.52,29.45 49.52,31.45 41.92,31.45
N$4
  Top 0.203: ID-BIT1.3 30.97,32.5 R206.1
N$6
  Top 0.203: ID-BIT0.3 34.32,32.55 R208.1
N$7  (via drill 0.35)  (1 unrouted)
  Top 0.406: v44.22,42.25 v41.92,42.25 | v43.12,42.25 43.12,38.52 TVS2.P$2
  Top 0.813: F2.P2 TVS2.P$2
  Bottom 0.406: v41.92,42.25 D2.2
N$8
  Top 0.5: 55.32,24.25 55.32,25.25 JD04.8
  pour Top: 53.22,18.25 53.22,26.15 53.62,26.55 55.42,26.55 55.72,26.25 55.72,24.65 56.92,23.45 56.92,18.35 56.82,18.25
N$9
  Top 0.203: DB0.A 34.32,31.55 37.02,31.55 37.02,34.05 R207.2
N$10
  Top 0.203: 31.07,31.6 DB1.A 30.97,31.55 28.22,31.55 28.22,34.45 R205.2
N$11  (via drill 0.35)
  Top 0.203: v18.58,53.2 18.52,53.14 18.52,52.18 DSOL.A
  Bottom 0.203: R903.1 19.41,54.02 v18.58,53.2
N$13  (via drill 0.35)
  Top 0.152: 51.61,60.05 51.27,60.05 50.42,60.9
  Top 0.203: JPROG.10 51.61,60.05 | 50.42,60.9 v50.07,60.9 49.87,60.7 49.37,60.7 48.07,59.4 D6.2
N$14
  Top 0.203: ID-BIT1.1 30.12,36.57 R211.2
N$15
  Top 0.203: ID-BIT0.1 35.32,36.57 R212.2
N$22  (1 unrouted)
  Top 0.203: 10.17,11.15 D5V.A
N$24  (via drill 0.35)
  Top 0.203: JPROG.1 53.25,54.55 53.52,54.27 53.52,51.65 v48.64,51.65
  Bottom 0.406: v48.64,51.65 48.64,46.49 F3.P1
N$25
  Top 0.203: R5.1 52.4,15.83 53.49,16.92 D12V.A
N$26  (via drill 0.35)
  Top 0.203: DRX.A 23.02,45.35 v20.02,45.35
  Bottom 0.203: R209.1 20.02,42 v20.02,45.35
N$27  (via drill 0.35)
  Top 0.203: DTX.A 24.88,45.15 23.98,44.25 21.93,44.25 21.62,44.55 v21.02,44.55
  Bottom 0.203: v21.02,44.55 20.87,44.4 R210.1
N$28
  Bottom 0.203: R3.1 R2.2 38.92,52.3 R8.1
N$29  (1 unrouted)
N$35
  Bottom 0.203: R304.1 35.29,30.43 U300.P3
N$36
  Bottom 0.203: U300.P2 36.82,31.96 36.82,30.65 37.37,30.65 R305.1
N$37
  Bottom 0.203: U300.P4 34.02,31.84 33.62,31.45 33.62,30.65 R306.1
N$38  (via drill 0.35)
  Top 0.203: v33.13,37.52 33.13,36.66 v32.62,36.15
  Bottom 0.203: U300.P5 33.66,37.52 v33.13,37.52 | R301.1 R307.1 41.97,36.6 41.62,36.25 32.72,36.25 v32.62,36.15
N$39  (via drill 0.35)
  Top 0.203: v38.62,34.45 38.62,38.25 v38.72,38.35
  Bottom 0.203: R302.1 R308.1 | R302.1 | R302.1 38.67,34.4 v38.62,34.45 | v38.72,38.35 38.25,37.87 U300.P8
N$40  (via drill 0.35)
  Top 0.203: v41.02,29.35 40.42,29.95 v40.42,32.35
  Bottom 0.203: R309.1 R303.1 41.67,30 v41.02,29.35 | v40.42,32.35 40.3,32.22 U300.P1
N$41
  Top 0.203: C609.1 28.28,25.2 28.3,25.18
  Top 0.305: 28.3,25.18 R604.1
N$43  (via drill 0.35)
  Top 0.203: DBOOT1.A 24.92,39.3 v24.92,40.15
  Bottom 0.203: 24.97,43.5 R103.2 25.02,41.1 R104.1 25.07,40.3 v24.92,40.15
N$44  (1 unrouted)
  Top 0.203: R101.2 31.05,58.97 | 31.05,58.97 31.13,58.89 | U100.6 32.19,59.55 32.02,59.55 31.45,58.97 31.05,58.97
N$47  (via drill 0.35)  (1 unrouted)
  Top 0.203: U600.P6 41.02,25.15 41.02,26.55 v40.92,26.65 | R610.2 24.27,27.95 v23.22,27.95
NRST  (via drill 0.35)
  Top 0.203: 32.39,58.51 U100.7 32.39,58.51 34.59,56.31 34.59,55.29 v34.62,55.25
  Bottom 0.203: 34.72,57.7 C105.1 34.67,57.4 34.62,57.35 v34.62,55.25
OSC_IN
  Top 0.203: C101.1 33.55,62.45 Q1.3 32.96,61.59 32.96,60.58 32.52,60.14 32.52,59.9 32.55,59.9 U100.5
OSC_OUT  (1 unrouted)
  Top 0.203: 29.82,60.2 R101.1 | R101.1 | 30.27,60.35 29.77,60.35 R101.1 | R101.1 29.62,60.4 | Q1.1 29,62.08 C102.1 R101.1
PA3/IMU_INT  (via drill 0.35)
  Top 0.203: U100.17 28.94,52.9 v28.57,52.9 | U500.12 34.72,44.55 v34.92,44.75
  Route2 0.203: v30.92,46.75 30.92,45.35 31.57,44.7 34.87,44.7 v34.92,44.75
  Bottom 0.203: v28.57,52.9 30.92,50.55 v30.92,46.75
PA4/SPI1_CSN  (via drill 0.35)
  Top 0.203: U100.20 29.46,50.77 v29.22,50.77 | U500.22 30.92,42.95 v30.12,43.75
  Bottom 0.203: v30.12,43.75 30.22,43.85 30.22,49.77 v29.22,50.77
PA5/SPI1_SCK  (via drill 0.35)
  Top 0.203: U100.21 29.26,49.86 v29.02,49.86 | v30.02,42.84 30.53,42.84 30.78,42.59 31.29,42.59 U500.23
  Bottom 0.203: v29.02,49.86 29.77,49.1 29.77,44.39 29.49,44.11 29.49,43.37 v30.02,42.84
PA6/SPI1_MISO  (via drill 0.35)
  Top 0.203: U100.22 29.05,48.95 v28.82,48.95 | v38.47,43.45 38.47,43.15 38.27,42.95 U500.9
  Route2 0.203: v38.47,43.45 38.39,43.37 37.26,43.37 36.58,44.05 31.4,44.05 30.69,44.76 v29.14,44.76
  Bottom 0.203: v28.82,48.95 29.17,48.59 29.17,44.79 v29.14,44.76
PA7/SPI1_MOSI  (via drill 0.35)
  Top 0.203: U100.23 28.1,47.29 v27.81,47.29 | v28.97,42.85 29.67,42.15 U500.24
  Bottom 0.203: v27.81,47.29 28.47,46.63 28.47,43.35 v28.97,42.85
PA9/USART1_TX  (via drill 0.35)  (1 unrouted)
  Top 0.203: U100.42 42.73,48.3 v45.17,48.3 | JPROG.2 51.38,55.2 46.78,55.2 v46.67,55.09
  Bottom 0.203: v45.17,48.3 45.17,48.95 46.12,49.9 46.12,54.8 46.41,55.09 v46.67,55.09
PA10/USART1_RX  (via drill 0.35)  (1 unrouted)
  Top 0.203: U100.43 42.79,48.95 v44.37,48.95 | v45.72,55.55 46.22,55.55 46.39,55.72 47,55.72 47.17,55.56 51.66,55.56 JPROG.4
  Bottom 0.203: v45.72,55.55 45.72,50.05 44.62,48.95 v44.37,48.95
PA11/USB_D-  (via drill 0.35)  (1 unrouted)
  Top 0.203: U100.44 42.8,49.65 v43.62,49.65 | JPROG.8 50.72,57.15 44.57,57.15 v44.47,57.05
  Bottom 0.203: v44.47,57.05 44.77,56.75 44.77,56 44.42,55.65 44.42,51.2 43.66,50.44 43.66,50.11 43.62,50.07 v43.62,49.65
PA12/USB_D+  (via drill 0.35)  (2 unrouted)
  Top 0.203: U100.45 42.77,50.38 v43.01,50.38 | v44.02,56.2 44.6,56.2 45.17,56.77 50.87,56.77 51.24,57.14 51.87,57.14
  Bottom 0.203: v43.01,50.38 44.02,51.4 v44.02,56.2
PB1/ADC1_IN9_PRSR  (via drill 0.35)
  Top 0.203: U100.27 33.32,49.68 v33.32,51.15
  Route2 0.203: v39.82,51.95 39.42,52.35 34.32,52.35 33.32,51.35 v33.32,51.15
  Bottom 0.203: C1.1 40.62,50.81 | 40.62,50.77 C1.1 | C1.1 40.64,52.28 R8.2 40.27,51.95 v39.82,51.95
PB2/BOOT1  (via drill 0.35)
  Top 0.203: JPROG.7 53.25,58.31 54.31,57.25 56.02,57.25 v56.07,57.21 | U100.28 32.5,48.15 30.88,48.15 28.1,45.38 28.1,44.99 27.84,44.72 v27.84,44.34
  Route2 0.203: v27.84,44.34 28.66,44.34 28.88,44.12 29.5,44.12 29.77,44.4 30.47,44.4 31.42,43.45 36.52,43.45 37.39,42.58 40.08,42.58 41.72,40.95 44.22,40.95 v46.82,43.55 | v47.22,54.15 48.92,55.85 54.82,55.85 55.12,55.55 55.72,55.55 56.12,55.95 56.12,57.21 v56.07,57.21
  Bottom 0.203: v27.84,44.34 27.06,44.34 26.82,44.1 R103.1 | v46.82,43.55 47.22,43.95 v47.22,54.15
PB6/I2C1_SCL  (via drill 0.35)  (1 unrouted)
  Top 0.203: U100.58 40.87,60.06 v40.87,62.5
PB7/I2C1_SDA  (via drill 0.35)  (1 unrouted)
  Top 0.203: U100.59 40.22,60.12 v40.22,61.55
PB12/CAN2_RX  (via drill 0.35)  (1 unrouted)
  Top 0.203: U100.33 39.16,45.51 39.16,42.15 v38.56,41.55 | v24.04,40.91 23.76,41.19 23.73,41.19 23.27,41.64 DRX.C
  Route2 0.203: v38.56,41.55 31.32,41.55 30.62,40.85 24.1,40.85 v24.04,40.91
  Bottom 0.203: 26.13,30.57 U200.4 | v24.04,40.91 23.84,40.71 23.84,32.85 24.32,32.37 25.2,32.37 26.33,31.24 U200.4 | U200.4 26.33,30.84
PB13/CAN2_TX  (via drill 0.35)  (1 unrouted)
  Top 0.203: DTX.C 25.42,43.15 | DTX.C 25.82,42.65 | U100.34 39.82,45.55 v39.82,41.95 | DTX.C 24.19,41.82 v23.99,41.82
  Route2 0.203: v23.99,41.82 24.16,41.65 30.32,41.65 30.85,42.18 39.82,42.18 v39.82,41.95
  Bottom 0.203: v23.99,41.82 23.89,41.82 23.38,41.31 23.38,32.7 22.62,31.95 22.62,30.88 U200.1
PC0/SSI_MCLKB  (via drill 0.35)
  Top 0.203: U100.8 33.95,56.37 v33.95,56.05
  Route2 0.203: v31.32,71.85 34.32,71.85 34.65,71.52 34.65,56.75 v33.95,56.05
  Bottom 0.203: U400.P6 31.37,71.9 v31.32,71.85
PC1/ADC1_IN11_TEMP2  (via drill 0.35)
  Top 0.203: U100.9 33.32,56.3 v33.32,55.25
  Route2 0.203: v27.92,56.55 29.92,54.55 32.62,54.55 v33.32,55.25
  Bottom 0.203: v33.32,55.25 C801.1 R802.2
PC2/SSI_MDIN  (via drill 0.35)
  Top 0.203: U100.10 32.65,56.26 v32.65,56.05
  Route2 0.203: v32.65,56.05 32.65,69.12 30.52,71.26 30.52,73.85 v31.12,74.45
  Bottom 0.203: U400.P8 v31.12,74.45
PC3/SSI_MDOUT  (via drill 0.35)
  Top 0.203: U100.11 32.02,56.18 v32.02,55.25
  Route2 0.203: v29.82,73.25 29.82,70.95 31.82,68.95 31.82,55.45 v32.02,55.25
  Bottom 0.203: U400.P7 29.87,73.2 v29.82,73.25
PC4/CAN_EN  (via drill 0.35)
  Top 0.203: U100.24 31.68,50.11 27.77,46.2 27.45,46.2 v27.42,46.23
  Route2 0.203: 21.74,46.23 v21.72,46.25 22.32,45.65 26.84,45.65 v27.42,46.23
  Bottom 0.203: U200.8 22.52,25.85 21.92,26.45 21.92,26.55 | v21.72,46.25 21.72,38.55 22.92,37.35 22.92,33.15 21.92,32.15 21.92,26.55 | R204.2 21.87,26.6 21.92,26.55
PC5/SOLENOID_EN  (via drill 0.35)  (1 unrouted)
  Top 0.203: v27.47,45.25 v27.48,45.25 U100.25
  Route2 0.203: v18.02,48.05 18.82,48.05 21.62,45.25 v27.47,45.25
  Bottom 0.203: R902.2 19.27,48.1 | 19.27,48.1 19.52,47.85 19.52,47.65 19.68,47.5 20.87,47.5 21.62,48.25 22.32,48.25 22.32,48.99 QN901.G | 19.27,48.1 18.07,48.1 v18.02,48.05
PC7/SSI_SCK  (via drill 0.35)
  Top 0.203: U100.38 35.32,52.88 v35.32,56.05
  Route2 0.203: v35.32,56.05 37.22,57.95 37.22,74.05 37.62,74.45 v40.52,74.45
  Bottom 0.203: U400.P1 v40.52,74.45
PRESSURE  (via drill 0.35)  (1 unrouted)
  Top 0.203: v12.22,39.55 14.72,39.55 16.12,38.15 28.02,38.15 29.52,39.65 v38.62,39.65
  Route2 0.203: JD04.1 54.82,46.5 53.77,45.45 50.17,45.45 44.62,39.9 38.62,39.9 v38.62,39.65
  Bottom 0.203: TVS3.3 14.77,39.5 15.32,38.95 16.32,38.95 17.72,40.35 JDPH.2 | R2.1 38.32,54.25
  Bottom 0.5: TVS3.3 12.27,39.5 v12.22,39.55
REGOUT2
  Top 0.203: C501.1 35.72,43.35 U500.10
RST  (via drill 0.35)
  Top 0.203: JPROG.9 52.62,60.3 52.62,61.8 v52.32,62.1
RT/CLK
  Top 0.203: U600.P9 34.02,25.05 32.52,25.05 32.42,25.15 R603.2
SCK  (via drill 0.35)
  Route2 0.203: 48.67,26.65 v48.97,26.35 48.23,26.35 48.22,26.36 42.41,26.36 42.07,26.02 39.15,26.02 37.12,28.05 37.12,29.1 v36.72,29.5
  Bottom 0.203: v36.72,29.5 36.72,29.4 37.57,28.55 R305.2 | JD04.9 50.27,45.19 50.27,40 51.07,39.19 52.07,39.19 52.97,38.3 52.97,30.25 52.67,29.95 51.42,29.95 50.62,29.15 50.62,27.95 49.02,26.35 v48.97,26.35
SHIELD
  Bottom 0.203: JD04.3 55.22,41.15 56.77,41.15 C2.1 R1.1
SPLIT
  Bottom 0.203: C202.1 20.72,21.75 20.82,21.85 | 20.82,21.85 20.82,23.2 R201.1 | 20.82,21.85 20.82,20.45 R202.2
SS
  Top 0.203: U600.P10 31.67,24.5 31.52,24.65 31.52,26 C605.1
SW  (via drill 0.35)
  Top 0.508: C612.1 39.47,19 v39.42,19.05
  Bottom 0.508: v39.42,19.05 v33.32,19.05
  pour Top: 33.92,15.65 33.92,21.05 24.92,21.05 24.92,15.65
  pour Top: 34.82,22.05 32.92,22.05 31.62,20.75 31.62,19.75 33.12,19.75 34.82,21.45
V_USB  (via drill 0.35)  (1 unrouted)
  Top 0.305: 47.84,50.85 57.32,50.85 58.72,49.45 v58.72,28.35
  Bottom 0.305: D1.2 58.72,27.4 v58.72,28.35
VCAP  (via drill 0.35)
  Top 0.203: v32.57,47.3 33.07,47.3 33.8,48.03 U100.30
  Bottom 0.203: 32.57,47.42 v32.57,47.3 C106.1

## Text on the board
tNames: GND / / +12V | PRESSURE | GND +12V / / GND PRSR | TEMP | ENCODER TLE5012B | +T2 +T1 / / -T2 -T1 | PRSR / / / GND / / / SHIELD / / / CANH / / / CANL / / / -TMP1 / / / +TMP1 / / / +12VIN | SCK / / CSQ / / DATA / / IFA / / IFB / / IFC / / 5V / / GND / ENC | KVR LABS / AEV ENC 1.01
bNames: KVR LABS / AEV ENC 0.0.1